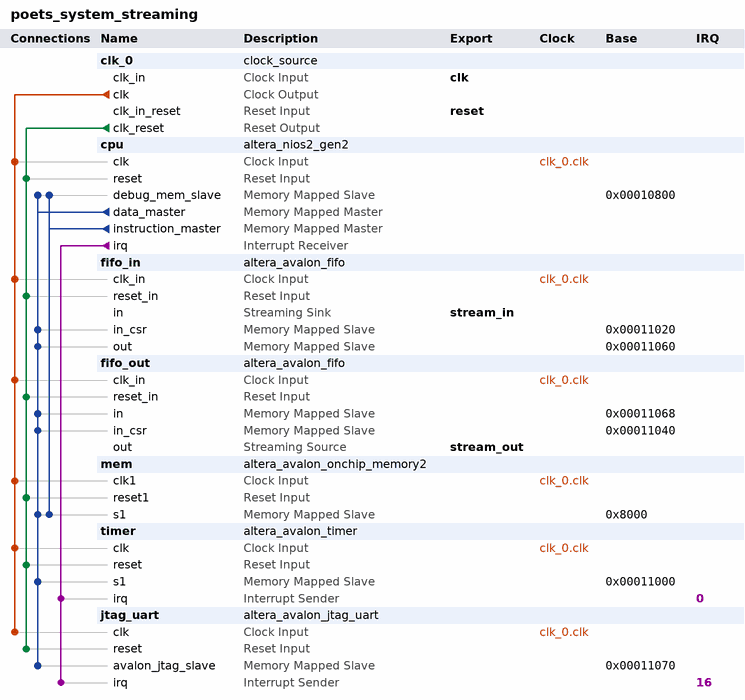
[diagram p0: system contents]
# Platform Designer (Qsys) system poets_system_streaming, Cyclone V 5CSEMA5F31C6
# Parameters at their usual value, and those the tool derives, are not listed.
package require -exact qsys 16.1
create_system poets_system_streaming
set_project_property DEVICE_FAMILY {Cyclone V}
set_project_property DEVICE 5CSEMA5F31C6

add_instance clk_0 clock_source 16.1
set_instance_parameter_value clk_0 clockFrequency 50000000

add_instance cpu altera_nios2_gen2 16.1
set_instance_parameter_value cpu dcache_size 1024
set_instance_parameter_value cpu exceptionSlave mem.s1
set_instance_parameter_value cpu icache_size 4096
set_instance_parameter_value cpu impl Tiny
set_instance_parameter_value cpu resetSlave mem.s1

add_instance fifo_in altera_avalon_fifo 16.1
set_instance_parameter_value fifo_in bitsPerSymbol 8
set_instance_parameter_value fifo_in channelWidth 0
set_instance_parameter_value fifo_in errorWidth 0
set_instance_parameter_value fifo_in fifoDepth 16
set_instance_parameter_value fifo_in fifoInputInterfaceOptions AVALONST_SINK
set_instance_parameter_value fifo_in fifoOutputInterfaceOptions AVALONMM_READ
set_instance_parameter_value fifo_in singleClockMode true
set_instance_parameter_value fifo_in symbolsPerBeat 4
set_instance_parameter_value fifo_in useIRQ false
set_instance_parameter_value fifo_in usePacket true
set_instance_parameter_value fifo_in useReadControl false
set_instance_parameter_value fifo_in useRegister true

add_instance fifo_out altera_avalon_fifo 16.1
set_instance_parameter_value fifo_out bitsPerSymbol 8
set_instance_parameter_value fifo_out channelWidth 0
set_instance_parameter_value fifo_out errorWidth 0
set_instance_parameter_value fifo_out fifoDepth 16
set_instance_parameter_value fifo_out fifoInputInterfaceOptions AVALONMM_WRITE
set_instance_parameter_value fifo_out fifoOutputInterfaceOptions AVALONST_SOURCE
set_instance_parameter_value fifo_out singleClockMode true
set_instance_parameter_value fifo_out symbolsPerBeat 4
set_instance_parameter_value fifo_out useIRQ false
set_instance_parameter_value fifo_out usePacket true
set_instance_parameter_value fifo_out useReadControl false
set_instance_parameter_value fifo_out useRegister true

add_instance mem altera_avalon_onchip_memory2 16.1
set_instance_parameter_value mem dataWidth 32
set_instance_parameter_value mem dualPort false
set_instance_parameter_value mem initMemContent true
set_instance_parameter_value mem initializationFileName onchip_mem.hex
set_instance_parameter_value mem memorySize 20480
set_instance_parameter_value mem readDuringWriteMode OLD_DATA
set_instance_parameter_value mem singleClockOperation true

add_instance timer altera_avalon_timer 16.1
set_instance_parameter_value timer period 1
set_instance_parameter_value timer periodUnits MSEC

add_instance jtag_uart altera_avalon_jtag_uart 16.1
set_instance_parameter_value jtag_uart simInteractiveOptions NO_INTERACTIVE_WINDOWS

# connections
add_connection clk_0.clk cpu.clk clock
add_connection clk_0.clk fifo_in.clk_in clock
add_connection clk_0.clk fifo_out.clk_in clock
add_connection clk_0.clk jtag_uart.clk clock
add_connection clk_0.clk mem.clk1 clock
add_connection clk_0.clk timer.clk clock
add_connection clk_0.clk_reset cpu.reset reset
add_connection clk_0.clk_reset fifo_in.reset_in reset
add_connection clk_0.clk_reset fifo_out.reset_in reset
add_connection clk_0.clk_reset jtag_uart.reset reset
add_connection clk_0.clk_reset mem.reset1 reset
add_connection clk_0.clk_reset timer.reset reset
add_connection cpu.data_master cpu.debug_mem_slave avalon
set_connection_parameter_value cpu.data_master/cpu.debug_mem_slave baseAddress 0x00010800
add_connection cpu.data_master fifo_in.in_csr avalon
set_connection_parameter_value cpu.data_master/fifo_in.in_csr baseAddress 0x00011020
add_connection cpu.data_master fifo_in.out avalon
set_connection_parameter_value cpu.data_master/fifo_in.out baseAddress 0x00011060
add_connection cpu.data_master fifo_out.in avalon
set_connection_parameter_value cpu.data_master/fifo_out.in baseAddress 0x00011068
add_connection cpu.data_master fifo_out.in_csr avalon
set_connection_parameter_value cpu.data_master/fifo_out.in_csr baseAddress 0x00011040
add_connection cpu.data_master jtag_uart.avalon_jtag_slave avalon
set_connection_parameter_value cpu.data_master/jtag_uart.avalon_jtag_slave baseAddress 0x00011070
add_connection cpu.data_master mem.s1 avalon
set_connection_parameter_value cpu.data_master/mem.s1 baseAddress 0x8000
add_connection cpu.data_master timer.s1 avalon
set_connection_parameter_value cpu.data_master/timer.s1 baseAddress 0x00011000
add_connection cpu.instruction_master cpu.debug_mem_slave avalon
set_connection_parameter_value cpu.instruction_master/cpu.debug_mem_slave baseAddress 0x00010800
add_connection cpu.instruction_master mem.s1 avalon
set_connection_parameter_value cpu.instruction_master/mem.s1 baseAddress 0x8000
add_connection cpu.irq jtag_uart.irq interrupt
set_connection_parameter_value cpu.irq/jtag_uart.irq irqNumber 16
add_connection cpu.irq timer.irq interrupt
set_connection_parameter_value cpu.irq/timer.irq irqNumber 0

# exported interfaces
add_interface clk clock sink
set_interface_property clk EXPORT_OF clk_0.clk_in
add_interface reset reset sink
set_interface_property reset EXPORT_OF clk_0.clk_in_reset
add_interface stream_in avalon_streaming sink
set_interface_property stream_in EXPORT_OF fifo_in.in
add_interface stream_out avalon_streaming source
set_interface_property stream_out EXPORT_OF fifo_out.out

set_interconnect_requirement {$system} qsys_mm.clockCrossingAdapter HANDSHAKE
set_interconnect_requirement {$system} qsys_mm.enableEccProtection FALSE
set_interconnect_requirement {$system} qsys_mm.insertDefaultSlave FALSE
set_interconnect_requirement {$system} qsys_mm.maxAdditionalLatency 1

save_system poets_system_streaming.qsys
